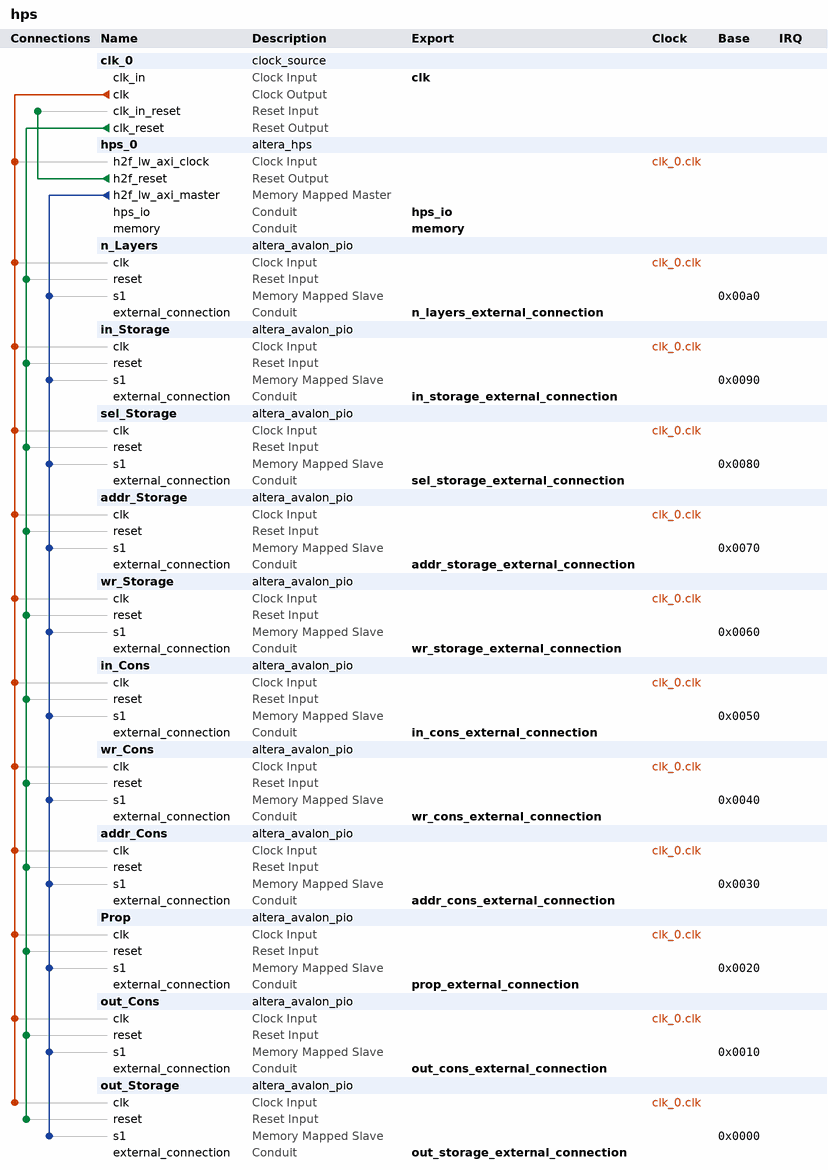
[diagram p0: system contents]
# Platform Designer (Qsys) system hps, Cyclone V 5CSXFC6D6F31C6
# Parameters at their usual value, and those the tool derives, are not listed.
package require -exact qsys 18.1
create_system hps
set_project_property DEVICE_FAMILY {Cyclone V}
set_project_property DEVICE 5CSXFC6D6F31C6

add_instance clk_0 clock_source 18.1
set_instance_parameter_value clk_0 clockFrequency 50000000

add_instance hps_0 altera_hps 18.1
set_instance_parameter_value hps_0 EMAC1_Mode RGMII
set_instance_parameter_value hps_0 EMAC1_PinMuxing {HPS I/O Set 0}
set_instance_parameter_value hps_0 F2SCLK_COLDRST_Enable false
set_instance_parameter_value hps_0 F2SCLK_DBGRST_Enable false
set_instance_parameter_value hps_0 F2SCLK_WARMRST_Enable false
set_instance_parameter_value hps_0 F2SINTERRUPT_Enable false
set_instance_parameter_value hps_0 F2S_Width 0
set_instance_parameter_value hps_0 FPGA_PERIPHERAL_OUTPUT_CLOCK_FREQ_EMAC0_GTX_CLK 125
set_instance_parameter_value hps_0 FPGA_PERIPHERAL_OUTPUT_CLOCK_FREQ_EMAC0_MD_CLK 2.5
set_instance_parameter_value hps_0 FPGA_PERIPHERAL_OUTPUT_CLOCK_FREQ_EMAC1_GTX_CLK 125
set_instance_parameter_value hps_0 FPGA_PERIPHERAL_OUTPUT_CLOCK_FREQ_EMAC1_MD_CLK 2.5
set_instance_parameter_value hps_0 HPS_PROTOCOL DDR3
set_instance_parameter_value hps_0 I2C0_Mode N/A
set_instance_parameter_value hps_0 I2C0_PinMuxing Unused
set_instance_parameter_value hps_0 I2C1_Mode N/A
set_instance_parameter_value hps_0 I2C1_PinMuxing Unused
set_instance_parameter_value hps_0 LWH2F_Enable true
set_instance_parameter_value hps_0 MEM_BANKADDR_WIDTH 3
set_instance_parameter_value hps_0 MEM_CLK_FREQ 400.0
set_instance_parameter_value hps_0 MEM_CLK_FREQ_MAX 400.0
set_instance_parameter_value hps_0 MEM_COL_ADDR_WIDTH 10
set_instance_parameter_value hps_0 MEM_DQ_WIDTH 32
set_instance_parameter_value hps_0 MEM_DRV_STR RZQ/6
set_instance_parameter_value hps_0 MEM_ROW_ADDR_WIDTH 15
set_instance_parameter_value hps_0 MEM_RTT_NOM RZQ/6
set_instance_parameter_value hps_0 MEM_RTT_WR {Dynamic ODT off}
set_instance_parameter_value hps_0 MEM_TCL 11
set_instance_parameter_value hps_0 MEM_TFAW_NS 45.0
set_instance_parameter_value hps_0 MEM_TRAS_NS 35.0
set_instance_parameter_value hps_0 MEM_TRCD_NS 13.75
set_instance_parameter_value hps_0 MEM_TRFC_NS 260.0
set_instance_parameter_value hps_0 MEM_TRP_NS 13.75
set_instance_parameter_value hps_0 MEM_VENDOR Micron
set_instance_parameter_value hps_0 MEM_WTCL 7
set_instance_parameter_value hps_0 QSPI_Mode N/A
set_instance_parameter_value hps_0 QSPI_PinMuxing Unused
set_instance_parameter_value hps_0 REF_CLK_FREQ 25.0
set_instance_parameter_value hps_0 S2FCLK_USER2CLK 5
set_instance_parameter_value hps_0 S2F_Width 0
set_instance_parameter_value hps_0 SDIO_Mode {4-bit Data}
set_instance_parameter_value hps_0 SDIO_PinMuxing {HPS I/O Set 0}
set_instance_parameter_value hps_0 SPIM1_Mode N/A
set_instance_parameter_value hps_0 SPIM1_PinMuxing Unused
set_instance_parameter_value hps_0 STM_Enable false
set_instance_parameter_value hps_0 TIMING_BOARD_AC_SKEW 0.02
set_instance_parameter_value hps_0 TIMING_BOARD_AC_TO_CK_SKEW 0.01
set_instance_parameter_value hps_0 TIMING_BOARD_DQ_TO_DQS_SKEW 0.05
set_instance_parameter_value hps_0 TIMING_BOARD_MAX_CK_DELAY 0.03
set_instance_parameter_value hps_0 TIMING_BOARD_MAX_DQS_DELAY 0.02
set_instance_parameter_value hps_0 TIMING_BOARD_SKEW_BETWEEN_DQS 0.06
set_instance_parameter_value hps_0 TIMING_BOARD_SKEW_CKDQS_DIMM_MAX 0.12
set_instance_parameter_value hps_0 TIMING_BOARD_SKEW_CKDQS_DIMM_MIN 0.06
set_instance_parameter_value hps_0 TIMING_BOARD_SKEW_WITHIN_DQS 0.01
set_instance_parameter_value hps_0 TIMING_TDH 65
set_instance_parameter_value hps_0 TIMING_TDQSCK 255
set_instance_parameter_value hps_0 TIMING_TDQSQ 125
set_instance_parameter_value hps_0 TIMING_TDS 30
set_instance_parameter_value hps_0 TIMING_TIH 140
set_instance_parameter_value hps_0 TIMING_TIS 190
set_instance_parameter_value hps_0 TIMING_TQSH 0.4
set_instance_parameter_value hps_0 UART0_Mode {No Flow Control}
set_instance_parameter_value hps_0 UART0_PinMuxing {HPS I/O Set 0}
set_instance_parameter_value hps_0 USB1_Mode SDR
set_instance_parameter_value hps_0 USB1_PinMuxing {HPS I/O Set 0}
set_instance_parameter_value hps_0 desired_cfg_clk_mhz 100.0
set_instance_parameter_value hps_0 desired_qspi_clk_mhz 400.0

add_instance n_Layers altera_avalon_pio 18.1
set_instance_parameter_value n_Layers direction Output
set_instance_parameter_value n_Layers width 8

add_instance in_Storage altera_avalon_pio 18.1
set_instance_parameter_value in_Storage direction Output
set_instance_parameter_value in_Storage width 24

add_instance sel_Storage altera_avalon_pio 18.1
set_instance_parameter_value sel_Storage direction Output
set_instance_parameter_value sel_Storage width 4

add_instance addr_Storage altera_avalon_pio 18.1
set_instance_parameter_value addr_Storage direction Output
set_instance_parameter_value addr_Storage width 8

add_instance wr_Storage altera_avalon_pio 18.1
set_instance_parameter_value wr_Storage direction Output
set_instance_parameter_value wr_Storage width 1

add_instance in_Cons altera_avalon_pio 18.1
set_instance_parameter_value in_Cons direction Output
set_instance_parameter_value in_Cons width 24

add_instance wr_Cons altera_avalon_pio 18.1
set_instance_parameter_value wr_Cons direction Output
set_instance_parameter_value wr_Cons width 1

add_instance addr_Cons altera_avalon_pio 18.1
set_instance_parameter_value addr_Cons direction Output
set_instance_parameter_value addr_Cons width 8

add_instance Prop altera_avalon_pio 18.1
set_instance_parameter_value Prop direction Output
set_instance_parameter_value Prop width 1

add_instance out_Cons altera_avalon_pio 18.1
set_instance_parameter_value out_Cons direction Input
set_instance_parameter_value out_Cons width 24

add_instance out_Storage altera_avalon_pio 18.1
set_instance_parameter_value out_Storage direction Input
set_instance_parameter_value out_Storage width 24

# connections
add_connection clk_0.clk addr_Cons.clk clock
add_connection clk_0.clk addr_Storage.clk clock
add_connection clk_0.clk hps_0.h2f_lw_axi_clock clock
add_connection clk_0.clk in_Cons.clk clock
add_connection clk_0.clk in_Storage.clk clock
add_connection clk_0.clk n_Layers.clk clock
add_connection clk_0.clk out_Cons.clk clock
add_connection clk_0.clk out_Storage.clk clock
add_connection clk_0.clk Prop.clk clock
add_connection clk_0.clk sel_Storage.clk clock
add_connection clk_0.clk wr_Cons.clk clock
add_connection clk_0.clk wr_Storage.clk clock
add_connection clk_0.clk_reset addr_Cons.reset reset
add_connection clk_0.clk_reset addr_Storage.reset reset
add_connection clk_0.clk_reset in_Cons.reset reset
add_connection clk_0.clk_reset in_Storage.reset reset
add_connection clk_0.clk_reset n_Layers.reset reset
add_connection clk_0.clk_reset out_Cons.reset reset
add_connection clk_0.clk_reset out_Storage.reset reset
add_connection clk_0.clk_reset Prop.reset reset
add_connection clk_0.clk_reset sel_Storage.reset reset
add_connection clk_0.clk_reset wr_Cons.reset reset
add_connection clk_0.clk_reset wr_Storage.reset reset
add_connection hps_0.h2f_reset clk_0.clk_in_reset reset
add_connection hps_0.h2f_lw_axi_master addr_Cons.s1 avalon
set_connection_parameter_value hps_0.h2f_lw_axi_master/addr_Cons.s1 baseAddress 0x0030
add_connection hps_0.h2f_lw_axi_master addr_Storage.s1 avalon
set_connection_parameter_value hps_0.h2f_lw_axi_master/addr_Storage.s1 baseAddress 0x0070
add_connection hps_0.h2f_lw_axi_master in_Cons.s1 avalon
set_connection_parameter_value hps_0.h2f_lw_axi_master/in_Cons.s1 baseAddress 0x0050
add_connection hps_0.h2f_lw_axi_master in_Storage.s1 avalon
set_connection_parameter_value hps_0.h2f_lw_axi_master/in_Storage.s1 baseAddress 0x0090
add_connection hps_0.h2f_lw_axi_master n_Layers.s1 avalon
set_connection_parameter_value hps_0.h2f_lw_axi_master/n_Layers.s1 baseAddress 0x00a0
add_connection hps_0.h2f_lw_axi_master out_Cons.s1 avalon
set_connection_parameter_value hps_0.h2f_lw_axi_master/out_Cons.s1 baseAddress 0x0010
add_connection hps_0.h2f_lw_axi_master out_Storage.s1 avalon
set_connection_parameter_value hps_0.h2f_lw_axi_master/out_Storage.s1 baseAddress 0x0000
add_connection hps_0.h2f_lw_axi_master Prop.s1 avalon
set_connection_parameter_value hps_0.h2f_lw_axi_master/Prop.s1 baseAddress 0x0020
add_connection hps_0.h2f_lw_axi_master sel_Storage.s1 avalon
set_connection_parameter_value hps_0.h2f_lw_axi_master/sel_Storage.s1 baseAddress 0x0080
add_connection hps_0.h2f_lw_axi_master wr_Cons.s1 avalon
set_connection_parameter_value hps_0.h2f_lw_axi_master/wr_Cons.s1 baseAddress 0x0040
add_connection hps_0.h2f_lw_axi_master wr_Storage.s1 avalon
set_connection_parameter_value hps_0.h2f_lw_axi_master/wr_Storage.s1 baseAddress 0x0060

# exported interfaces
add_interface addr_cons_external_connection conduit end
set_interface_property addr_cons_external_connection EXPORT_OF addr_Cons.external_connection
add_interface addr_storage_external_connection conduit end
set_interface_property addr_storage_external_connection EXPORT_OF addr_Storage.external_connection
add_interface clk clock sink
set_interface_property clk EXPORT_OF clk_0.clk_in
add_interface hps_io conduit end
set_interface_property hps_io EXPORT_OF hps_0.hps_io
add_interface in_cons_external_connection conduit end
set_interface_property in_cons_external_connection EXPORT_OF in_Cons.external_connection
add_interface in_storage_external_connection conduit end
set_interface_property in_storage_external_connection EXPORT_OF in_Storage.external_connection
add_interface memory conduit end
set_interface_property memory EXPORT_OF hps_0.memory
add_interface n_layers_external_connection conduit end
set_interface_property n_layers_external_connection EXPORT_OF n_Layers.external_connection
add_interface out_cons_external_connection conduit end
set_interface_property out_cons_external_connection EXPORT_OF out_Cons.external_connection
add_interface out_storage_external_connection conduit end
set_interface_property out_storage_external_connection EXPORT_OF out_Storage.external_connection
add_interface prop_external_connection conduit end
set_interface_property prop_external_connection EXPORT_OF Prop.external_connection
add_interface sel_storage_external_connection conduit end
set_interface_property sel_storage_external_connection EXPORT_OF sel_Storage.external_connection
add_interface wr_cons_external_connection conduit end
set_interface_property wr_cons_external_connection EXPORT_OF wr_Cons.external_connection
add_interface wr_storage_external_connection conduit end
set_interface_property wr_storage_external_connection EXPORT_OF wr_Storage.external_connection

set_interconnect_requirement {$system} qsys_mm.clockCrossingAdapter HANDSHAKE
set_interconnect_requirement {$system} qsys_mm.enableEccProtection FALSE
set_interconnect_requirement {$system} qsys_mm.insertDefaultSlave FALSE
set_interconnect_requirement {$system} qsys_mm.maxAdditionalLatency 1

save_system hps.qsys
